# Altium schematic sheet SCH_05_USB_To_TTL.SchDoc
size A4; DrawnBy: Phung Nhat Minh; SheetNumber: 5; SheetTotal: 7
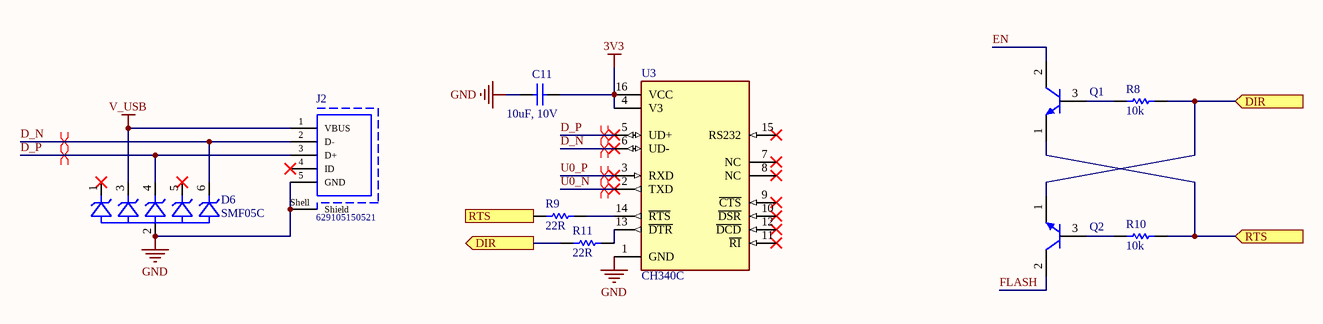
[diagram p0: SCH_05_USB_To_TTL.SchDoc]

## Parts
C11  10uF, 10V  [WCAP-CSGP_0603_H=0.8mm_Reflow]
D6  SMF05C  [SC70-6]
J2  629105150521  [629105150521]
Q1  C1815  [SOT23B]  (value not drawn)
Q2  C1815  [SOT23B]  (value not drawn)
R8  value 10k  [RES-SM-0603]  (hidden comment: RESISTOR SMD)
R9  value 22R  [RES-SM-0603]  (hidden comment: RESISTOR SMD)
R10  value 10k  [RES-SM-0603]  (hidden comment: RESISTOR SMD)
R11  value 22R  [RES-SM-0603]  (hidden comment: RESISTOR SMD)
U3  CH340C  [SOIC127P600X180-16N]

## Ports
DIR (in, see SCH_05_USB_To_TTL[2C]), DIR (out, see SCH_05_USB_To_TTL[4B]), RTS (in, see SCH_05_USB_To_TTL[2C]), RTS (out, see SCH_05_USB_To_TTL[4C])

## Nets
3V3: C11.2 U3.4(V3) U3.16(VCC)
GND: C11.1 D6.2(A) J2.5(GND) J2.Shell(Shield) U3.1(GND)
V_USB: D6.3(C2) J2.1(VBUS)
D_N: D6.6(C5) J2.2(D-) U3.6(UD-)
D_P: D6.4(C3) J2.3(D+) U3.5(UD+)
DIR: Q2.1(E) R8.2 R11.1 ; port DIR
EN: Q1.2(C)
FLASH: Q2.2(C)
RTS: Q1.1(E) R9.1 R10.2 ; port RTS
U0_N: U3.2(TXD)
U0_P: U3.3(RXD)
NetQ1_3: Q1.3(B) R8.1
NetQ2_3: Q2.3(B) R10.1
NetR9_2: R9.2 U3.14(~{RTS})
NetR11_2: R11.2 U3.13(~{DTR})

Not connected (* = marked no-connect by the designer): D6 1(C1)* 5(C4)*; J2 4(ID)*; U3 7(NC)* 8(NC)* 9(~{CTS})* 10(~{DSR})* 11(~{RI})* 12(~{DCD})* 15(RS232)*

## Layout directives
differential pair: D_N, D_P, U0_N, U0_P

## Notes on the sheet
- Title
- Size
- Date:
- A4
- Number
- Revision
- Time:
- Drawn By:
- Checked By:

## Library data of the parts
C11 = 885012206020: WCAP-CSGP Multilayer Ceramic Chip Capacitor, General Purpose, size 0603, X7R, 100nF, 10V; Manufacturer: Wurth Elektronik; Rated Voltage: 10VDC; Isolation Resistance: >=5GOhm; Capacitance Tolerance: +/-10%; Technical Reference: X7R0603104K010DFCT10000; ComponentLink1Description: Manufacturer; ComponentLink1URL: http://www.we-online.de; ComponentLink2Description: Datasheet; ComponentLink2URL: https://www.we-online.com/catalog/datasheet/885012206020.pdf; Operating Temperature: -55 to +125degC; Packaging: Tape and Reel; Manufacturer Part Number: 885012206020; Published Date: May 2020; Ceramic Type: X7R; Dissipation Factor: =<5%; Height: 0.8mm; Mounting Technology: SMT; Size: 0603; Capacitance: 100nF
D6 = SMF05C: 12.5V Clamp 8A (8/20Âµs) Ipp Tvs Diode Surface Mount SC-88/SC70-6/SOT-363; MF: ProTek Devices; Price: None; Availability: In Stock; MP: SMF05C; Package: TSSOP-6 ProTek Devices; SnapEDA_Link: https://www.snapeda.com/parts/SMF05C/Protek+Devices/view-part/?ref=snap; Check_prices: https://www.snapeda.com/parts/SMF05C/Protek+Devices/view-part/?ref=eda; Value: *
J2 = 629105150521: Micro USB 2.0 Type B Receptacle WR-COM, Horizontal, SMT, with Pegs, High Current at Pin 1 & Pin 5; Rated Current: 3 A; Contact Resistance: 30 mOhm; Working Voltage: 30 VAC; ComponentLink1Description: Manufacturer; ComponentLink1URL: http://www.we-online.de; ComponentLink2Description: Datasheet; ComponentLink2URL: https://katalog.we-online.de/em/datasheet/629105150521.pdf; Part Number: 629105150521; Published Date: September 2018; Publisher: Wurth Elektronik; Orientation: Horizontal; Connector Type: Micro USB 2.0 Type B; Operating Temperature: -40 to 85 degC; Mounting Technology: SMT; Gender: Receptacle; Packaging: Tape and Reel
Q1 Q2 = C1815: NPN Bipolar Transistor
R8-R11 = RESISTOR SMD: Resistor